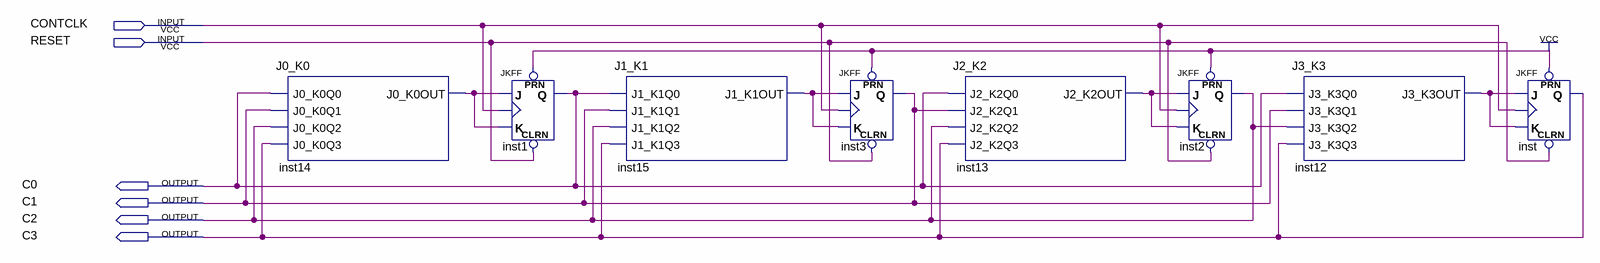
[diagram p0: schematic sheet]
// Quartus schematic contador.bdf as structural Verilog: 8 symbols, 6 pins
module contador (
  input  CONTCLK,
  input  RESET,
  output C0,
  output C1,
  output C2,
  output C3
);

  wire inst12_j3_k3out, inst13_j2_k2out, inst14_j0_k0out, inst15_j1_k1out;

  J0_K0 inst14 (.J0_K0Q0(C0), .J0_K0Q1(C1), .J0_K0Q2(C2), .J0_K0Q3(C3), .J0_K0OUT(inst14_j0_k0out));
  JKFF inst1 (.PRN(1'b1), .CLRN(RESET), .K(inst14_j0_k0out), .J(inst14_j0_k0out), .CLK(CONTCLK), .Q(C0));
  J1_K1 inst15 (.J1_K1Q0(C0), .J1_K1Q1(C1), .J1_K1Q2(C2), .J1_K1Q3(C3), .J1_K1OUT(inst15_j1_k1out));
  JKFF inst3 (.PRN(1'b1), .CLRN(RESET), .K(inst15_j1_k1out), .J(inst15_j1_k1out), .CLK(CONTCLK), .Q(C1));
  J2_K2 inst13 (.J2_K2Q0(C0), .J2_K2Q1(C1), .J2_K2Q2(C2), .J2_K2Q3(C3), .J2_K2OUT(inst13_j2_k2out));
  JKFF inst2 (.PRN(1'b1), .CLRN(RESET), .K(inst13_j2_k2out), .J(inst13_j2_k2out), .CLK(CONTCLK), .Q(C2));
  J3_K3 inst12 (.J3_K3Q0(C0), .J3_K3Q1(C1), .J3_K3Q2(C2), .J3_K3Q3(C3), .J3_K3OUT(inst12_j3_k3out));
  JKFF inst (.PRN(1'b1), .CLRN(RESET), .K(inst12_j3_k3out), .J(inst12_j3_k3out), .CLK(CONTCLK), .Q(C3));
endmodule
